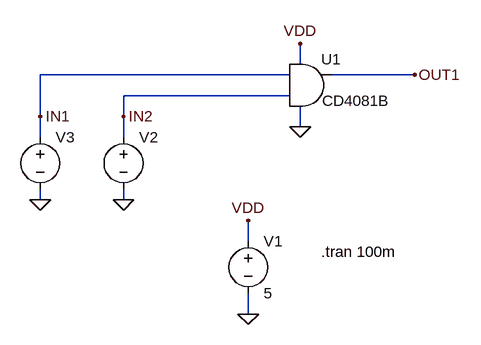
[diagram p0: schematic CD4081B.asc]
CD4081B.asc, the LTspice schematic file:
Version 4.1
SHEET 1 880 680
WIRE 240 144 240 112
WIRE 224 160 -160 160
WIRE 416 160 288 160
WIRE 224 192 -32 192
WIRE -160 224 -160 160
WIRE -32 224 -32 192
WIRE 240 240 240 208
WIRE -160 256 -160 224
WIRE -32 256 -32 224
WIRE -160 352 -160 336
WIRE -32 352 -32 336
WIRE 160 416 160 384
WIRE 160 528 160 496
FLAG 160 528 0
FLAG 160 384 VDD
FLAG 240 112 VDD
FLAG 240 240 0
FLAG 416 160 OUT1
FLAG -32 352 0
FLAG -160 352 0
FLAG -160 224 IN1
FLAG -32 224 IN2
SYMBOL voltage 160 400 R0
WINDOW 123 0 0 Left 0
WINDOW 39 0 0 Left 0
SYMATTR InstName V1
SYMATTR Value 5
SYMBOL voltage -32 240 R0
WINDOW 3 -48 4 Invisible 2
WINDOW 123 0 0 Left 0
WINDOW 39 0 0 Left 0
SYMATTR Value PULSE(0 5 0 1n 1n {0.5/50} {1/50})
SYMATTR InstName V2
SYMBOL voltage -160 240 R0
WINDOW 3 -48 4 Invisible 2
WINDOW 123 0 0 Left 0
WINDOW 39 0 0 Left 0
SYMATTR Value PULSE(0 5 0 1n 1n {0.5/100} {1/100})
SYMATTR InstName V3
SYMBOL MyLib\\Digital\\CD4081B 256 112 R0
SYMATTR InstName U1
TEXT 272 432 Left 2 !.tran 100m

The netlist it stands for:
* CD4081B.asc
V1 VDD 0 5
V2 IN2 0 PULSE(0 5 0 1n 1n {0.5/50} {1/50})
V3 IN1 0 PULSE(0 5 0 1n 1n {0.5/100} {1/100})
X§U1 IN1 IN2 OUT1 VDD 0 CD4081B vdd=5 speed=2 tripdt=20n  ; pins A B Y VDD GND
.tran 100m
.lib MyLib/Digital/_CD4xxx.lib
.backanno
.end